# Altium project ZynqPi.PrjPcb (part 2 of 2)

## Sheet Miscellaneous.SchDoc
size A3; SheetNumber: 9; SheetTotal: 9
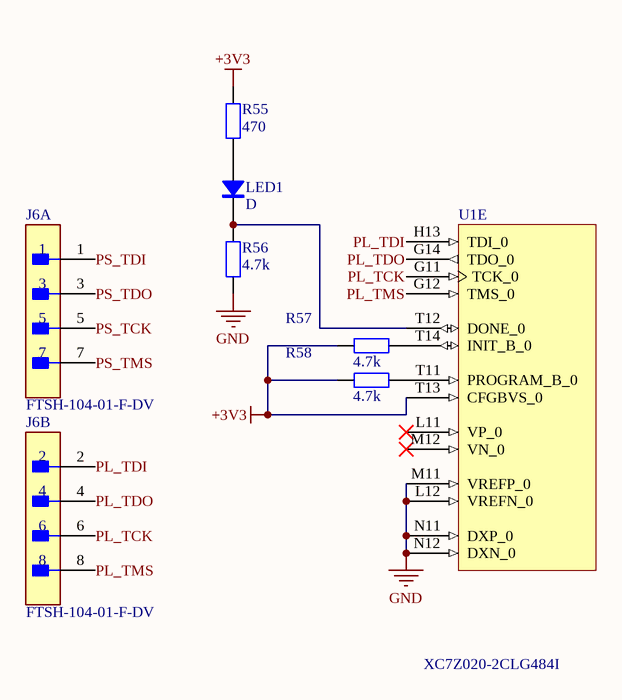
[diagram p7: Miscellaneous.SchDoc]

### Parts
J6  FTSH-104-01-F-DV  [FP-FTSH-104-01-F-DV-MFG]  (parts A,B of 2)
LED1  D  [R0603]
R55  470  [R0402]
R56  4.7k  [R0402]
R57  4.7k  [R0402]
R58  4.7k  [R0402]
U1  XC7Z020-2CLG484I  [CLG484]  (part E of 10)

### Nets
+3V3: R55.1 R57.1 R58.1 U1.T13(CFGBVS_0)
GND: R56.2 U1.L12(VREFN_0) U1.M11(VREFP_0) U1.N11(DXP_0) U1.N12(DXN_0)
PL_TCK: J6.6 U1.G11(TCK_0)
PL_TDI: J6.2 U1.H13(TDI_0)
PL_TDO: J6.4 U1.G14(TDO_0)
PL_TMS: J6.8 U1.G12(TMS_0)
PS_TCK: J6.5
PS_TDI: J6.1
PS_TDO: J6.3
PS_TMS: J6.7
NetLED1_1: LED1.1(A) R55.2
NetLED1_2: LED1.2(K) R56.1 U1.T12(DONE_0)
NetR57_2: R57.2 U1.T14(INIT_B_0)
NetR58_2: R58.2 U1.T11(PROGRAM_B_0)

Not connected (* = marked no-connect by the designer): U1 L11(VP_0)* M12(VN_0)*

### Library data of the parts
J6 = CMP-02766-001469-1: CONN HEADER SMD 8POS 1.27MM; Gender: Male; Number of Contacts: 8; Housing Material: Polymer; Contact Plating: Gold; Orientation: Straight; Max Operating Temperature: 125°C; Length: 5.08mm; Lead Free: Lead Free; Housing Color: Black; Contact Material: Bronze; Depth: 3.43mm; Number of Rows: 2; Pitch: 1.27mm; Termination: Solder; Packaging: Rail/Tube; Radiation Hardening: No; RoHS Compliant: Yes; Min Operating Temperature: -55°C
R55-R58 = R
U1 = CMP-0363-00013-3: 733 MHz Zynq™-7000 AP SoC, 130 PS I/O, 200 FPGA I/O, 484-Ball BGA, Speed Grade 2, Industrial Grade, Pb-Free; Speed Grade: -2; Flip Flops: 106400; LUTs: 53200; Extensible Block RAM (# 36Kb Blocks): 560 KB (140); ComponentLink3URL: http://www.xilinx.com/support/documentation/data_sheets/ds187-XC7Z010-XC7Z020-Data-Sheet.pdf; PackageReference: CLG484; Code_JEDEC: MO-275-PPAA-2; ComponentLink2URL: http://www.xilinx.com/support/documentation/user_guides/ug865-Zynq-7000-Pkg-Pinout.pdf; ComponentLink2Description: Package Specification; ComponentLink6URL: http://www.xilinx.com/support/documentation/user_guides/ug483_7Series_PCB.pdf; PackageVersion: Rev 1.1, 09/2012; DatasheetVersion: v1.2; PartNumber: XC7Z020-2CLG484I; ComponentLink3Description: DC and AC Switching Characteristics; PackageDescription: Wire-Bond Chip-Scale BGA, Body 19 x 19 mm, 0.8 mm Pitch; RoHS: Pb-Free; ComponentLink5URL: http://www.xilinx.com/support/documentation/user_guides/ug865-Zynq-7000-Pkg-Pinout.pdf; ComponentLink1URL: http://www.xilinx.com/support/documentation/data_sheets/ds190-Zynq-7000-Overview.pdf; ComponentLink4Description: Package File; Generic Part Number: XC7Z020; Mounting Technology: Surface Mount; ComponentLink1Description: Datasheet; ComponentLink4URL: http://www.xilinx.com/support/packagefiles/z7packages/xc7z020clg484pkg.txt; ComponentLink6Description: PCB and Layout Guide; ComponentLink5Description: Packaging and Pinout

## Nets that join several sheets
+1V0: Power (35 pins), MIO (U6.3 U6.8 U6.21 U6.38)
+1V8: Power (35 pins), Bank34 (16 pins)
+3V3: Power (28 pins), DDR (C1.2 C2.2 R5.2 U4.10), MIO (25 pins), Bank33 (6 pins), Bank34 (10 pins), Bank35 (P2.1 P2.17), Miscellaneous (R55.1 R57.1 R58.1 U1.T13)
GND: Power (116 pins), DDR (80 pins), MIO (39 pins), Bank33 (6 pins), Bank34 (22 pins), Bank35 (8 pins), Miscellaneous (5 pins)
VBUS: Power (14 pins), Bank35 (P2.2 P2.4)
VMEM: Power (14 pins), DDR (55 pins)
PS_TCK: MIO (U1.C5), Miscellaneous (J6.5)
PS_TDI: MIO (U1.G7), Miscellaneous (J6.1)
PS_TDO: MIO (U1.B4), Miscellaneous (J6.3)
PS_TMS: MIO (U1.A6), Miscellaneous (J6.7)